# EAGLE design RM (EAGLE 5.10)
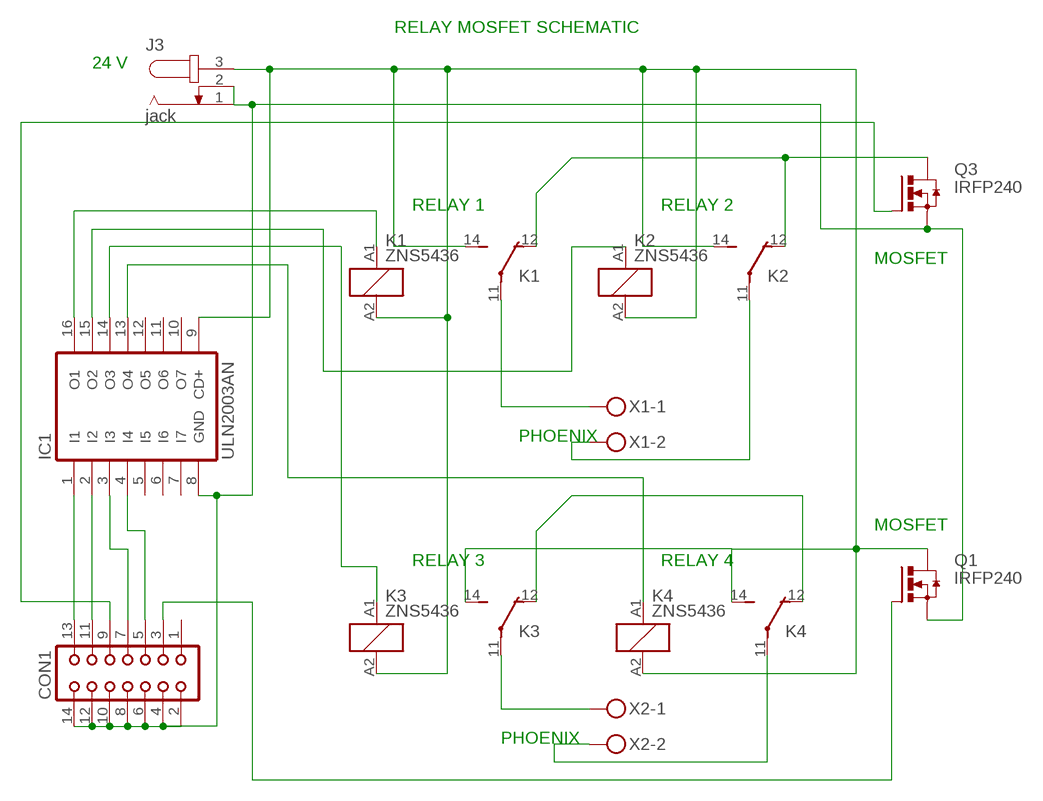
[diagram p0: schematic, sheet 1]

## Parts
CON1  CON14  [CON14]
IC1  ULN2003AN  [DIL16]
J3  jack  JACK-PLUG0  [SPC4077]
K1  ZNS5436  [ZN5]
K2  ZNS5436  [ZN5]
K3  ZNS5436  [ZN5]
K4  ZNS5436  [ZN5]
Q1  IRFP240  [TO247BV]
Q3  IRFP240  [TO247BV]
X1  MKDSN1,5/2-5,08  [MKDSN1,5/2-5,08]
X2  MKDSN1,5/2-5,08  [MKDSN1,5/2-5,08]

## Nets
N$1: K1.11(2:P) X1.1
N$2: IC1.16(O1) K1.A1
N$3: K2.11(2:P) X1.2
N$4: IC1.15(O2) K2.A1
N$5: K3.11(2:P) X2.1
N$6: IC1.9(CD+) J3.3 K1.14(2:S) K1.A2 K2.14(2:S) K2.A2 K3.14(2:S) K3.A2 K4.14(2:S) K4.A2 Q1.D
N$7: CON1.13 IC1.1(I1)
N$8: K4.11(2:P) X2.2
N$9: CON1.11 IC1.2(I2)
N$10: CON1.7 IC1.3(I3)
N$11: IC1.14(O3) K3.A1
N$12: IC1.13(O4) K4.A1
N$13: CON1.9 Q3.G
N$14: CON1.2 CON1.4 CON1.6 CON1.8 CON1.10 CON1.12 CON1.14 IC1.8(GND) J3.1 J3.2 Q1.S Q3.S
N$15: K3.12(2:O) K4.12(2:O)
N$16: CON1.3 Q1.G
N$18: CON1.5 IC1.4(I4)
N$19: K1.12(2:O) K2.12(2:O) Q3.D
Unconnected: CON1.1 IC1.5(I5) IC1.6(I6) IC1.7(I7) IC1.10(O7) IC1.11(O6) IC1.12(O5)

## Notes on the sheet
- RELAY MOSFET SCHEMATIC
- 24 V
- RELAY 1 | RELAY 2
- MOSFET
- PHOENIX
- MOSFET
- RELAY 3 | RELAY 4
- PHOENIX

## Library data of the parts
CON1 = con-harting:CON14: CONNECTOR
IC1 = uln-udn:ULN2003A: DRIVER ARRAY
J3 = con-jack:JACK-PLUG: DC POWER JACK Power Jack, DC, Right Angle, Through Hole, Rated 5A at 16VDC, PC Terminals Distributor: Farnell (www.Farnell.de) Drawing: 84N1161.pdf / 84N1162.pdf Manufacturer: SPC Technology (www.spctechnology.com) Type: SPC4077 / SPC 4078
K1-K4 = relay1:ZNS5*: Miniature Power PCB Relay SCHRACK 1pole 10 A Source: http://www.schrack.com/.. 5847.pdf
Q1 Q3 = transistor-power:IRFP240: HEXFET Power MosFet Source: http://www.irf.com/
X1 X2 = con-phoenix-508:MKDSN1,5/2-5,08: MKDSN 1,5/ 2-5,08 Printklemme Nennstrom: 13,5 A Nennspannung: 250 V Rastermaß: 5,08 mm Polzahl: 2 Anschlussart: Schraubanschluss Montage: Löten Anschlussrichtung Leiter/Platine: 0 ° Artikelnummer: 1729128 Source: http://eshop.phoenixcontact.com .. 1729128.pdf

## Board
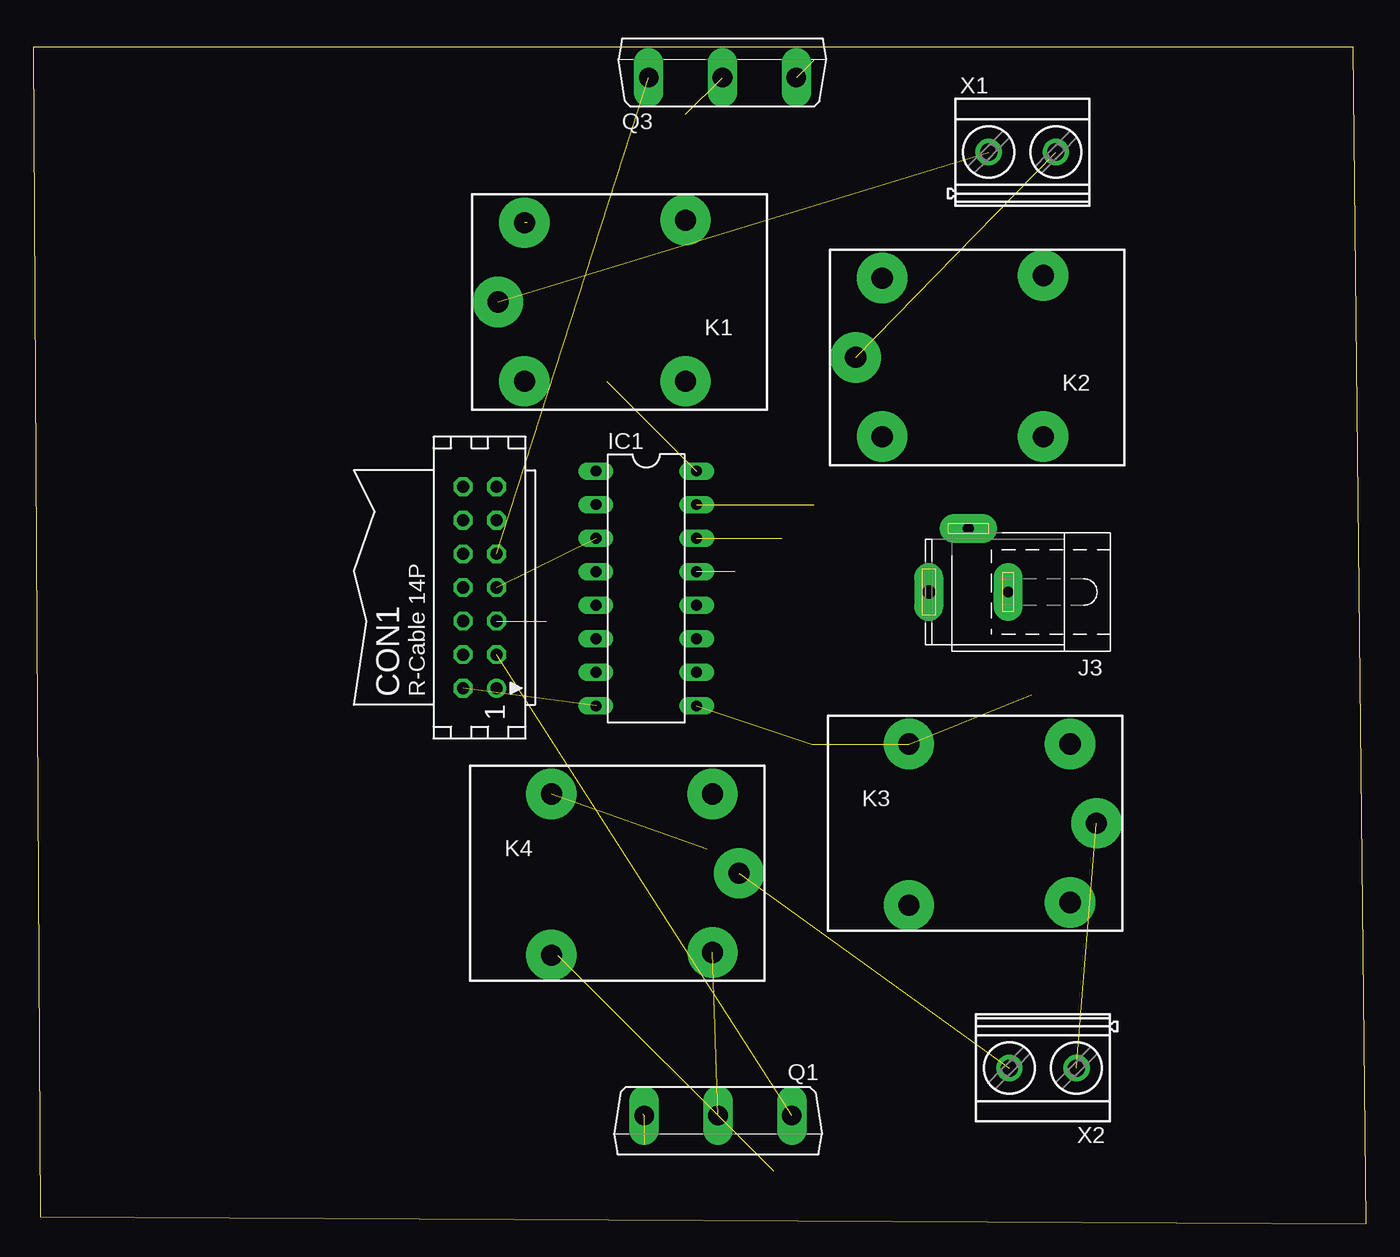
[diagram p1: board, top side]
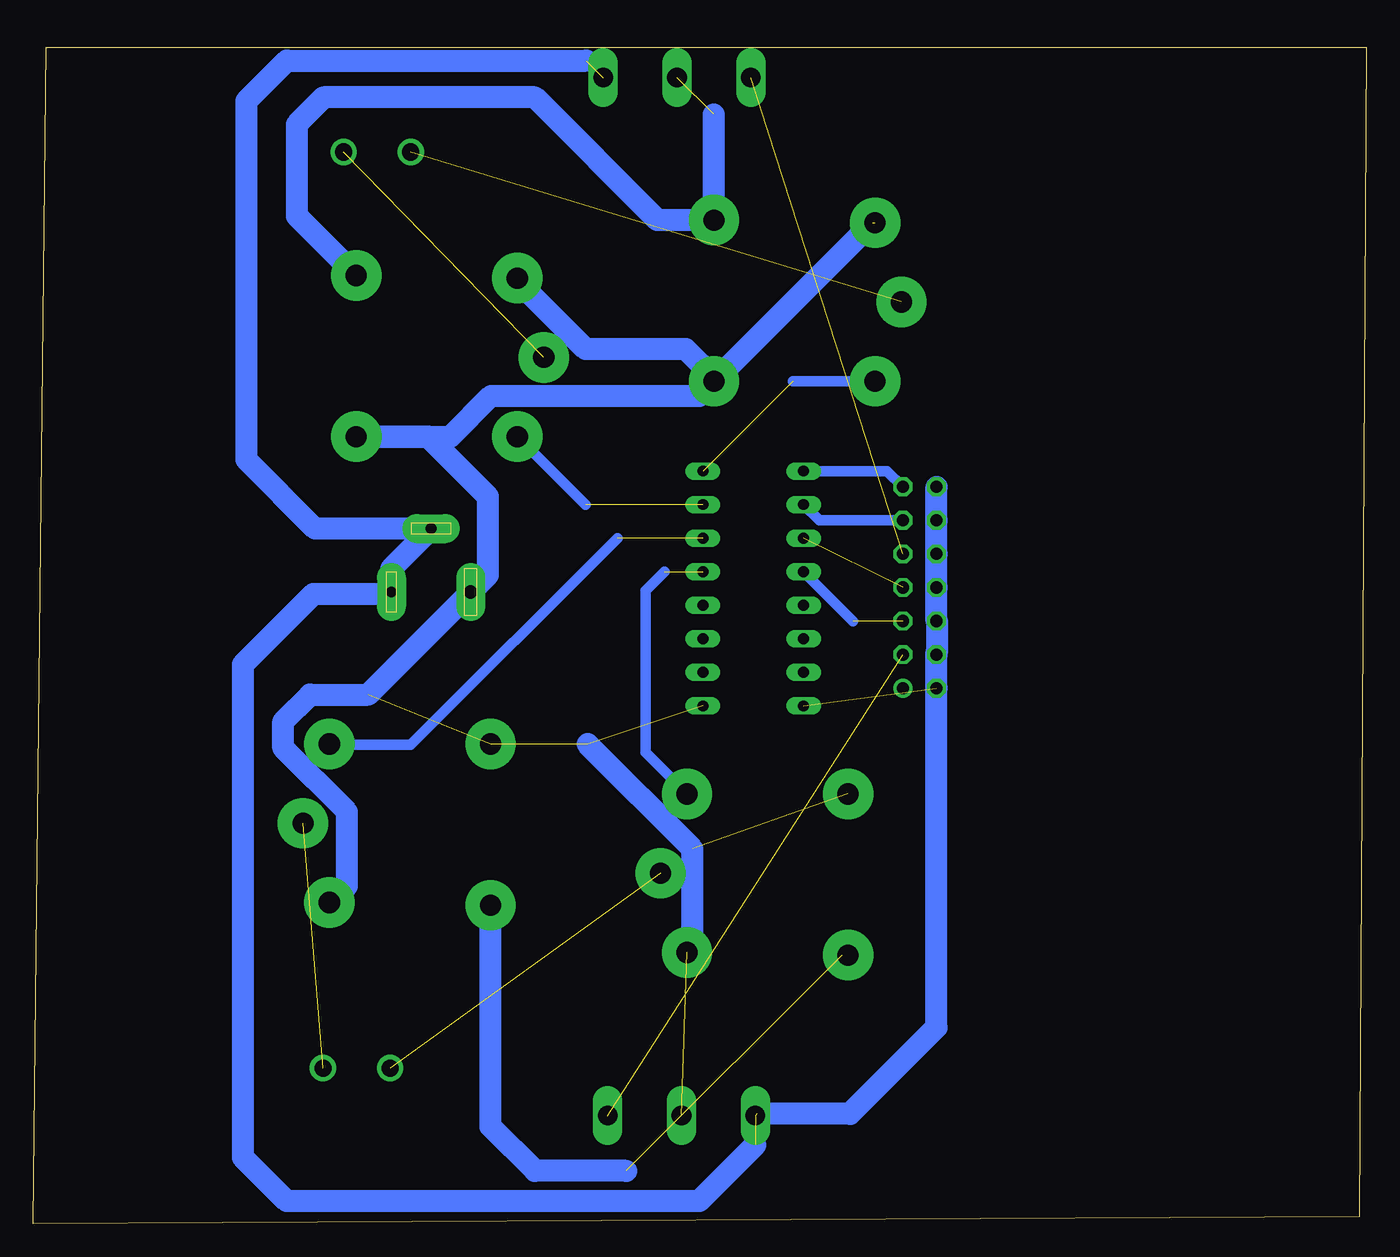
[diagram p2: board, bottom side, seen from below]

Size 101 x 89.08 mm. Coordinates in mm from the lower left corner, seen from the top.
Outline: 0.54,0.54 101,0 100,89.08 0,89.08 0.54,0.54
Copper layers (1*16): Top 0.035mm / dielectric 1.5mm / Bottom 0.035mm
Design rules "default": minimum track width 10mil, minimum drill 24mil, track to track 8mil, track to pad 8mil, pad to pad 8mil, via to via 8mil, smd to smd 8mil, copper to edge 40mil, drill to drill 8mil, minimum pad ring 10mil, minimum via ring 8mil, stop-mask expansion 4mil, vias tented up to drill 0mil, thermal gap 10mil

### Footprints (pad centres in the part's own frame; a part is rotated, then mirrored left to right if it is on the bottom)
CON14 = drill 0.914 round: 1 -7.62,-1.27 | drill 0.914 octagon: 2 -7.62,1.27; 3 -5.08,-1.27; 4 -5.08,1.27; 5 -2.54,-1.27; 6 -2.54,1.27; 7 0,-1.27; 8 0,1.27; 9 2.54,-1.27; 10 2.54,1.27; 11 5.08,-1.27; 12 5.08,1.27; 13 7.62,-1.27; 14 7.62,1.27
DIL16 = drill 0.813 long: 1 -8.89,-3.81; 2 -6.35,-3.81; 3 -3.81,-3.81; 4 -1.27,-3.81; 5 1.27,-3.81; 6 3.81,-3.81; 7 6.35,-3.81; 8 8.89,-3.81; 9 8.89,3.81; 10 6.35,3.81; 11 3.81,3.81; 12 1.27,3.81; 13 -1.27,3.81; 14 -3.81,3.81; 15 -6.35,3.81; 16 -8.89,3.81
SPC4077 = drill 0.8 pad 2.184 long: 1 -3,0; 2 0,-4.8 | drill 1 pad 2.184 long: 3 3,0
ZN5 = drill 1.6 pad 3.81 round: 11 8.89,0; 12 -5.31,-6.2; 14 -5.31,6; A1 6.89,6; A2 6.89,-6
TO247BV = drill 1.499 long: D 0,-2.921; G -5.588,-2.921; S 5.588,-2.921
MKDSN1,5/2-5,08 = drill 1.3 pad 2 round: 1 -2.561,0.025; 2 2.519,0.025

### Placement (x,y rotation side)
CON1  33.84,48.18 90 top
IC1  46.45,48.1 270 top
J3  70.85,47.83 180 top
K1  44.11,69.79 180 top
K2  71.21,65.6 180 top
K3  71.66,30.32 0 top
K4  44.58,26.54 0 top
Q1  51.88,5.27 180 top
Q3  52.22,89.71 0 top
X1  74.95,81.12 0 top
X2  76.47,11.81 180 top

### Tracks (layer width: path | path; a pad name or v marks a point on that pad's centre or on a via)
N$1  (1 unrouted)
N$2  (1 unrouted)
  Bottom 0.813: K1.A1 43.46,63.79
N$3  (1 unrouted)
N$4  (1 unrouted)
  Bottom 0.813: 59.17,54.45 K2.A1
N$5  (1 unrouted)
N$6  (6 unrouted)
  Bottom 1.676: 78.35,24.32 K3.A2 78.49,24.32 77.22,25.59 77.22,31.18 82.04,36 82.04,38.04 80.01,40.07 75.61,40.07 J3.3 66.55,49.13 66.55,55.05 71.09,59.6 K2.14 69.37,59.6 66.29,62.67 50.54,62.67 K1.14 | K4.A2 51.02,20.98 51.05,21.02 51.05,28.38 58.99,36.32 | K2.A2 64.52,71.6 59.15,66.23 51.56,66.23 49.42,64.09 K1.14 | K1.14 37.42,75.79
N$7
  Bottom 0.813: CON1.13 36.31,56.99 IC1.1
N$8  (1 unrouted)
N$9
  Bottom 0.813: CON1.11 41.45,53.26 IC1.2
N$10  (1 unrouted)
N$11  (1 unrouted)
  Bottom 0.813: 56.74,51.91 72.39,36.26 78.49,36.26 K3.A1
N$12  (1 unrouted)
  Bottom 0.813: 53.18,49.37 54.61,47.94 54.61,35.68 K4.A1
N$13  (1 unrouted)
N$14  (4 unrouted)
  Bottom 1.676: 59.1,88.07 81.79,88.07 84.84,85.03 84.84,57.85 79.62,52.63 J3.2 73.85,49.63 J3.1 73.99,47.69 79.76,47.69 85.09,42.35 85.09,5.02 81.79,1.71 50.55,1.71 46.29,5.97 | CON1.14 CON1.12 CON1.10 CON1.8 CON1.6 32.51,45.58 32.51,43.37 32.57,43.31 CON1.4 CON1.2 32.57,14.86 39.12,8.32 46.16,8.32
N$15  (1 unrouted)
  Bottom 1.676: K3.12 66.35,7.36 62.99,4 56.07,4 | K4.12 39.73,20.34
N$16  (1 unrouted)
N$18  (1 unrouted)
  Bottom 0.813: 38.91,45.64 IC1.4
N$19  (1 unrouted)
  Bottom 1.676: K2.12 81.03,76.31 81.03,83.25 78.99,85.28 62.99,85.28 53.7,75.99 K1.12 49.42,83.99